# Altium schematic sheet SAU-G0-EX_microSD.SchDoc: SAU-G0-EX_microSD
size A4; Address1: Draw By: OldGerman; Revision: v1.0; SheetNumber: 1; SheetTotal: 1
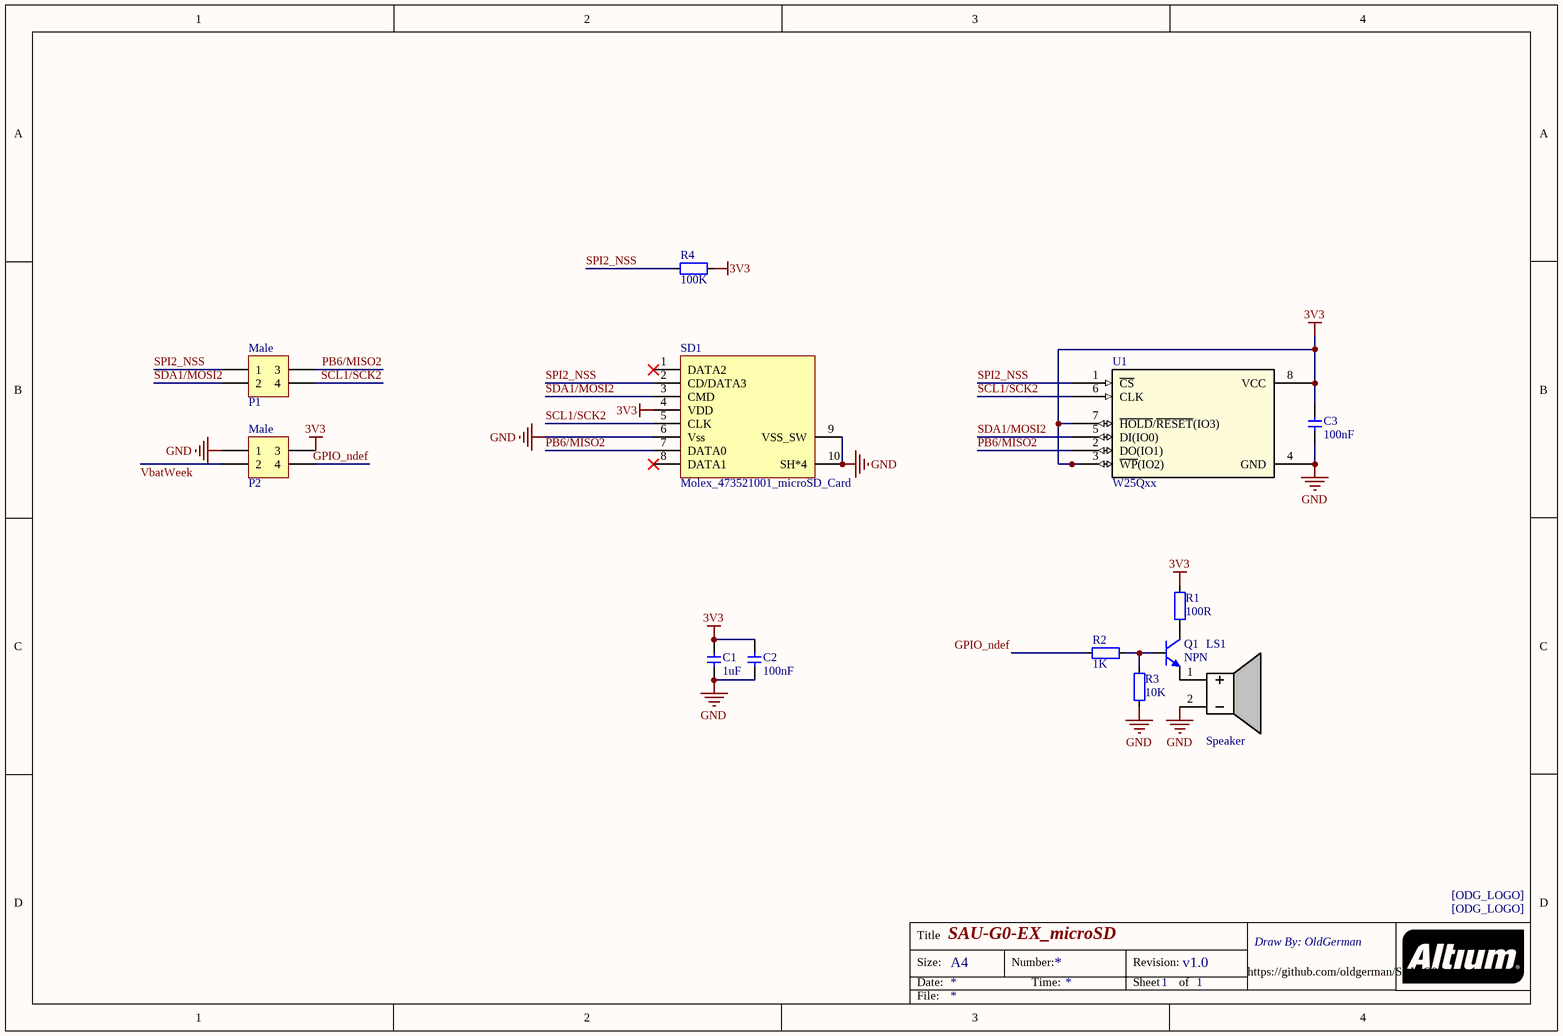
[diagram p0: SAU-G0-EX_microSD.SchDoc]

## Parts
C1  1uF  [C0402]
C2  100nF  [C0402]
C3  100nF  [C0402]
LS1  Speaker  [压电陶瓷蜂鸣片12MM]
ODG1  ODG_LOGO  [ODG_LOGO_soldermask]  (value not drawn)
ODG2  ODG_LOGO  [ODG_LOGO_soldermask]  (value not drawn)
P1  Male  [2.0mm_Male_2x2]
P2  Male  [2.0mm_Male_2x2]
Q1  NPN  [DIODES SOT-323-3]
R1  100R  [R0402]
R2  1K  [R0402]
R3  10K  [R0402]
R4  100K  [R0402]
SD1  Molex_473521001_microSD_Card  [molex_473521001_microSD_Card]
U1  W25Qxx  [WIN_SS-8_WIN-L]

## Nets
3V3: C1.2 C2.2 C3.1 P2.3 R1.2 R4.2 SD1.4(VDD) U1.3(~{WP}(IO2)) U1.7(~{HOLD}/~{RESET}(IO3)) U1.8(VCC)
GND: C1.1 C2.1 C3.2 LS1.2(-) P2.1 R3.1 SD1.6(Vss) SD1.9(VSS_SW) SD1.10(SH*4) U1.4(GND)
GPIO_ndef: P2.4 R2.1
PB6/MISO2: P1.3 SD1.7(DATA0) U1.2(DO(IO1))
SCL1/SCK2: P1.4 SD1.5(CLK) U1.6(CLK)
SDA1/MOSI2: P1.2 SD1.3(CMD) U1.5(DI(IO0))
SPI2_NSS: P1.1 R4.1 SD1.2(CD/DATA3) U1.1(~{CS})
VbatWeek: P2.2
NetLS1_1: LS1.1(+) Q1.2(E)
NetQ1_1: Q1.1(B) R2.2 R3.2
NetQ1_3: Q1.3(C) R1.1

Not connected (* = marked no-connect by the designer): SD1 1(DATA2)* 8(DATA1)*

## Notes on the sheet
- https://github.com/oldgerman/SAU-G0
- Title
- Size:
- Date:
- A4
- Number:
- Time:
- Revision:
- Sheet
- of
- File:
- (in symbol ODG_LOGO) [ODG_LOGO]

## Library data of the parts
C1-C3 = CAP: Capacitor; Value: 0.1u
LS1 = Speaker: 蜂鸣器
P1 P2 = CONN_2X2
Q1 = NPN: NPN型; BOM名称: 高频放大-NPN型; 版权归属: 源创客; 属性: 40V 1.5A 1W 100MHZ; 学习资源: www.ooocke.com
R1-R4 = RES: Resistor; Value: 22R
SD1 = Molex_473521001_microSD_Card: 473521001 / 1.10mm Pitch microSD Card Connector, Push-Push Type, with VSS (Supply Voltage Ground) Detect Switch, Lead-Free
U1 = W25Qxx: No Description Available; Mfr_Name: Winbond; Manufacturer_Part_Number: W25Q16DVSSIG; Copyright: Copyright (C) 2022 Ultra Librarian. All rights reserved.; RefDes: RefDes; Type: DEV